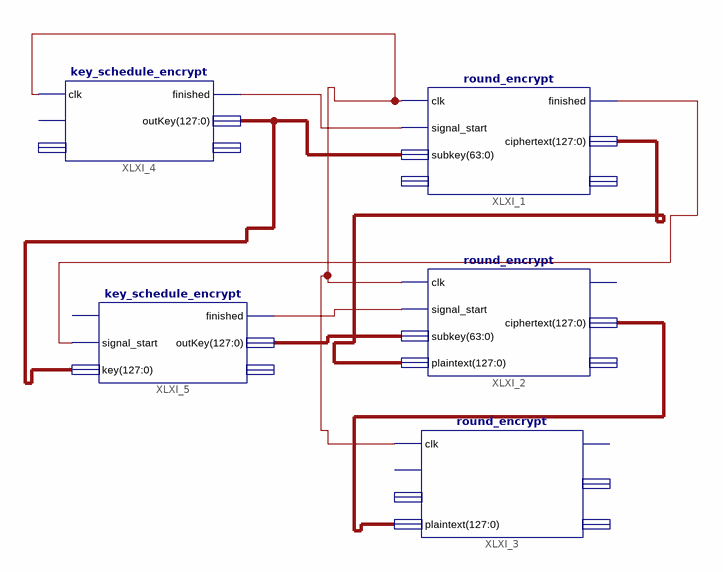
[diagram p0: schematic sheet 1]
// Xilinx ISE schematic encrypt_schematic.sch (spartan6) as structural Verilog: 5 symbols, 0 ports
module encrypt_schematic (
);

  wire XLXN_1, XLXN_2, XLXN_16, XLXN_21;
  wire [127:0] XLXN_5, XLXN_8, XLXN_14, XLXN_22;

  round_encrypt XLXI_1 (
    .clk(XLXN_16), .signal_start(XLXN_1), .subkey(XLXN_14), .finished(XLXN_2), .ciphertext(XLXN_5));  // open: plaintext, state_response
  round_encrypt XLXI_2 (
    .clk(XLXN_16), .signal_start(XLXN_21), .subkey(XLXN_22), .plaintext(XLXN_5), .ciphertext(XLXN_8));  // open: finished, state_response
  round_encrypt XLXI_3 (
    .clk(XLXN_16), .plaintext(XLXN_8));  // open: signal_start, subkey, finished, ciphertext, state_response
  key_schedule_encrypt XLXI_4 (
    .clk(XLXN_16), .finished(XLXN_1), .outKey(XLXN_14));  // open: signal_start, key, state_response
  key_schedule_encrypt XLXI_5 (
    .signal_start(XLXN_2), .key(XLXN_14), .finished(XLXN_21), .outKey(XLXN_22));  // open: clk, state_response
endmodule
